# Altium schematic sheet Plugs.SchDoc
size A4
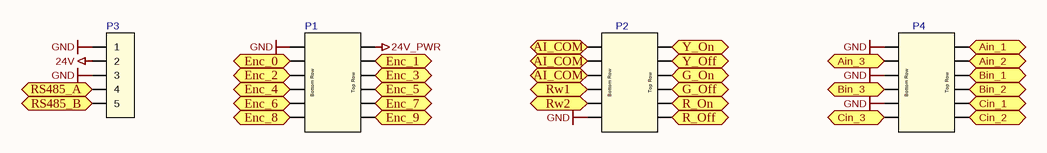
[diagram p0: Plugs.SchDoc]

## Parts
P1  Conncector 6x2  [Connector 6x2]  (value not drawn)
P2  Conncector 6x2  [Connector 6x2]  (value not drawn)
P3  Conncector X2X  [Connector X2X]  (value not drawn)
P4  Conncector 6x2  [Connector 6x2]  (value not drawn)

## Ports
AI_COM, Ain_1, Ain_2, Ain_3, Bin_1, Bin_2, Bin_3, Cin_1, Cin_2, Cin_3, Enc_0, Enc_1, Enc_2, Enc_3, Enc_4, Enc_5, Enc_6, Enc_7, Enc_8, Enc_9, G_Off, G_On, R_Off, R_On, RS485_A, RS485_B, Rw1, Rw2, Y_Off, Y_On

## Nets
24V: P3.2
24V_PWR: P1.2
GND: P1.1 P2.11 P3.1 P3.3 P4.1 P4.5 P4.9
AI_COM: P2.1 P2.3 P2.5 ; port AI_COM
Ain_1: P4.2 ; port Ain_1
Ain_2: P4.4 ; port Ain_2
Ain_3: P4.3 ; port Ain_3
Bin_1: P4.6 ; port Bin_1
Bin_2: P4.8 ; port Bin_2
Bin_3: P4.7 ; port Bin_3
Cin_1: P4.10 ; port Cin_1
Cin_2: P4.12 ; port Cin_2
Cin_3: P4.11 ; port Cin_3
Enc_0: P1.3 ; port Enc_0
Enc_1: P1.4 ; port Enc_1
Enc_2: P1.5 ; port Enc_2
Enc_3: P1.6 ; port Enc_3
Enc_4: P1.7 ; port Enc_4
Enc_5: P1.8 ; port Enc_5
Enc_6: P1.9 ; port Enc_6
Enc_7: P1.10 ; port Enc_7
Enc_8: P1.11 ; port Enc_8
Enc_9: P1.12 ; port Enc_9
G_Off: P2.8 ; port G_Off
G_On: P2.6 ; port G_On
R_Off: P2.12 ; port R_Off
R_On: P2.10 ; port R_On
RS485_A: P3.4 ; port RS485_A
RS485_B: P3.5 ; port RS485_B
Rw1: P2.7 ; port Rw1
Rw2: P2.9 ; port Rw2
Y_Off: P2.4 ; port Y_Off
Y_On: P2.2 ; port Y_On

## Notes on the sheet
- (in symbol Conncector 6x2) Bottom Row; Top Row

## Library data of the parts
P1 P2 P4 = Conncector 6x2: MCD 1,5/6-G1-3,81 PCB Connector
P3 = Connector X2X: EMSTBA 2,5/ 5-G-5,08 PCB Connector